# Altium schematic sheet Sheet1.SchDoc
size A3
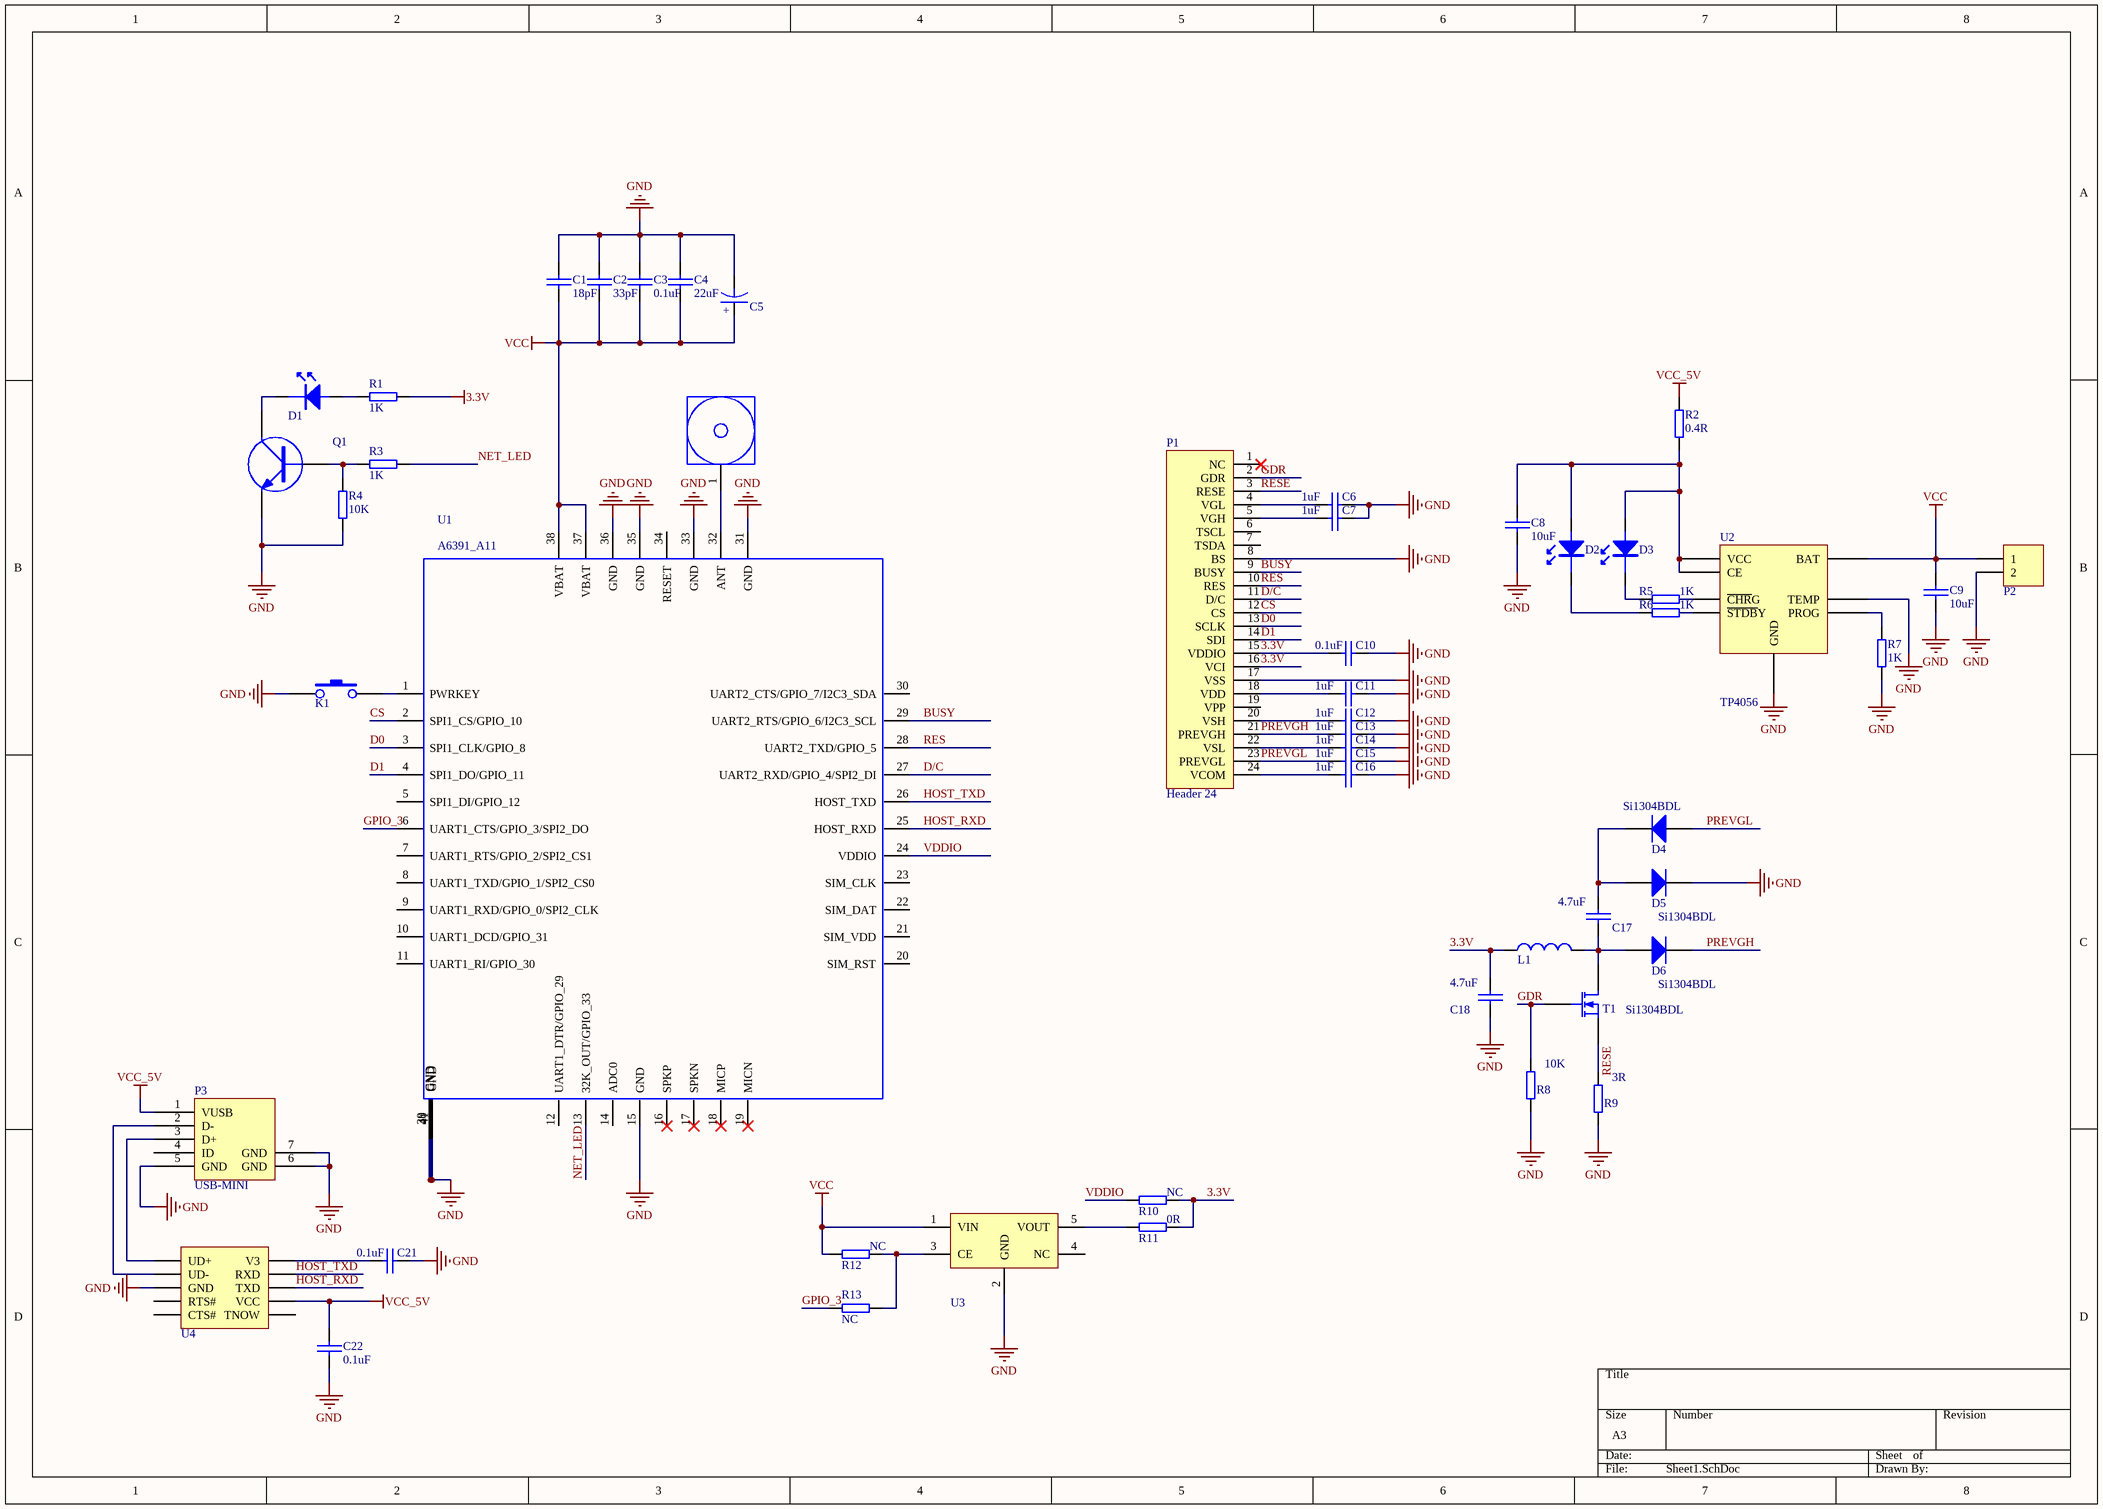
[diagram p0: Sheet1.SchDoc]

## Parts
ANTENNA  ANTENNA  [GSM/GPRS/3G弹簧天线]  (value not drawn)
C1  18pF  [0603C-Cap]
C2  33pF  [0603C-Cap]
C3  0.1uF  [0603C-Cap]
C4  22uF  [0603C-Cap]
C5  Cap_C  [CAPM-B-3528X21N]  (value not drawn)
C6  1uF  [0603C-Cap]
C7  1uF  [0603C-Cap]
C8  10uF  [0603C-Cap]
C9  10uF  [0603C-Cap]
C10  0.1uF  [0603C-Cap]
C11  1uF  [0603C-Cap]
C12  1uF  [0603C-Cap]
C13  1uF  [0603C-Cap]
C14  1uF  [0603C-Cap]
C15  1uF  [0603C-Cap]
C16  1uF  [0603C-Cap]
C17  4.7uF  [0603C-Cap]
C18  4.7uF  [0603C-Cap]
C21  0.1uF  [0603C-Cap]
C22  0.1uF  [0603C-Cap]
D1  LED  [LED0603_B]  (value not drawn)
D2  LED  [LED0603_B]  (value not drawn)
D3  LED  [LED0603_B]  (value not drawn)
D4  Si1304BDL  [SOD323]
D5  Si1304BDL  [SOD323]
D6  Si1304BDL  [SOD323]
K1  SW_PB2  [KEY_4*4]  (value not drawn)
L1  10uH  [3225 - duplicate]  (value not drawn)
P1  Header 24  [FH12-24S-0.5SH]
P2  Header 2  [2PIN]  (value not drawn)
P3  USB-MINI  [Micro USB]
Q1  8050  [SOT-23]  (value not drawn)
R1  1K  [0603C-Res]
R2  0.4R  [0603C-Res]
R3  1K  [0603C-Res]
R4  10K  [0603C-Res]
R5  1K  [0603C-Res]
R6  1K  [0603C-Res]
R7  1K  [0603C-Res]
R8  10K  [0603C-Res]
R9  3R  [0603C-Res]
R10  NC  [0603C-Res]
R11  0R  [0603C-Res]
R12  NC  [0603C-Res]
R13  NC  [0603C-Res]
T1  Si1304BDL  [SOT-23]
U1  A6391_A11  [202]
U2  TP4056  [SOP8LM386]
U3  ME6211C33  [SOT-23-5PIN]  (value not drawn)
U4  CH340E  [TSSOP50P490X110-10N]  (value not drawn)

## Nets
3.3V: C10.2 C18.2 L1.1 P1.15(VDDIO) P1.16(VCI) R1.2 R10.2 R11.2
GND: C1.1 C2.1 C3.1 C4.1 C5.2 C6.1 C7.1 C8.2 C9.2 C10.1 C11.1 C12.1 C13.1 C14.1 C15.1 C16.1 C18.1 C21.1 C22.1 D5.2(K) K1.1 P1.8(BS) P1.17(VSS) P2.2 P3.5(GND) P3.6(GND) P3.7(GND) Q1.2(E) R4.1 R7.2 R8.1 R9.1 U1.15(GND) U1.31(GND) U1.33(GND) U1.35(GND) U1.36(GND) U1.39(GND) U1.40(GND) U1.41(GND) U2.1(TEMP) U2.3(GND) U3.2(GND) U4.3(GND)
VCC: C1.2 C2.2 C3.2 C4.2 C5.1 C9.1 P2.1 R12.1 U1.37(VBAT) U1.38(VBAT) U2.5(BAT) U3.1(VIN)
VCC_5V: C22.2 P3.1(VUSB) R2.1 U4.7(VCC)
BUSY: P1.9(BUSY) U1.29(UART2_RTS/GPIO_6/I2C3_SCL)
CS: P1.12(CS) U1.2(SPI1_CS/GPIO_10)
D0: P1.13(SCLK) U1.3(SPI1_CLK/GPIO_8)
D1: P1.14(SDI) U1.4(SPI1_DO/GPIO_11)
D/C: P1.11(D/C) U1.27(UART2_RXD/GPIO_4/SPI2_DI)
GDR: P1.2(GDR) R8.2 T1.1(G)
GPIO_3: R13.2 U1.6(UART1_CTS/GPIO_3/SPI2_DO)
HOST_RXD: U1.25(HOST_RXD) U4.8(TXD)
HOST_TXD: U1.26(HOST_TXD) U4.9(RXD)
NET_LED: R3.1 U1.13(32K_OUT/GPIO_33)
PREVGH: C13.2 D6.2(K) P1.21(PREVGH)
PREVGL: C15.2 D4.1(A) P1.23(PREVGL)
RES: P1.10(RES) U1.28(UART2_TXD/GPIO_5)
RESE: P1.3(RESE) R9.2 T1.2(S)
VDDIO: R10.1 U1.24(VDDIO)
NetANTENNA_1: ANTENNA.1 U1.32(ANT)
NetC6_2: C6.2 P1.4(VGL)
NetC7_2: C7.2 P1.5(VGH)
NetC8_1: C8.1 D2.A D3.A R2.2 U2.4(VCC) U2.8(CE)
NetC11_2: C11.2 P1.18(VDD)
NetC12_2: C12.2 P1.20(VSH)
NetC14_2: C14.2 P1.22(VSL)
NetC16_2: C16.2 P1.24(VCOM)
NetC17_1: C17.1 D6.1(A) L1.2 T1.3(D)
NetC17_2: C17.2 D4.2(K) D5.1(A)
NetC21_2: C21.2 U4.10(V3)
NetD1_A: D1.A R1.1
NetD1_K: D1.K Q1.3(C)
NetD2_K: D2.K R6.2
NetD3_K: D3.K R5.2
NetK1_2: K1.2 U1.1(PWRKEY)
NetP3_2: P3.2(D-) U4.2(UD-)
NetP3_3: P3.3(D+) U4.1(UD+)
NetQ1_1: Q1.1(B) R3.2 R4.2
NetR5_1: R5.1 U2.7(~{CHR}G)
NetR6_1: R6.1 U2.6(~{STDB}Y)
NetR7_1: R7.1 U2.2(PROG)
NetR11_1: R11.1 U3.5(VOUT)
NetR12_2: R12.2 R13.1 U3.3(CE)

Not connected (* = marked no-connect by the designer): P1 1(NC)* 6(TSCL) 7(TSDA) 19(VPP); P3 4(ID); U1 5(SPI1_DI/GPIO_12) 7(UART1_RTS/GPIO_2/SPI2_CS1) 8(UART1_TXD/GPIO_1/SPI2_CS0) 9(UART1_RXD/GPIO_0/SPI2_CLK) 10(UART1_DCD/GPIO_31) 11(UART1_RI/GPIO_30) 12(UART1_DTR/GPIO_29) 14(ADC0) 16(SPKP)* 17(SPKN)* 18(MICP)* 19(MICN)* 20(SIM_RST) 21(SIM_VDD) 22(SIM_DAT) 23(SIM_CLK) 30(UART2_CTS/GPIO_7/I2C3_SDA) 34(RESET); U3 4(NC); U4 4(RTS#) 5(CTS#) 6(TNOW)

## Notes on the sheet
- (in symbol Cap_C) +

## Library data of the parts
C1-C4 C6-C18 C21 C22 = Cap: ceramics
C5 = Cap_C: Electrolytic
D1-D3 = LED: 发光二极管
D4-D6 = Diode BAS16
L1 = Inductor
P1 = Header 24: Header, 7-Pin
P3 = USB-MINI: MINUSB
Q1 = NPN
R1-R13 = RES: 电阻
T1 = N_MOS
U1 = A6391_A11: 202芯片; Geometry.Height: 2.3 MM; PCB DECAL: A6391_A11